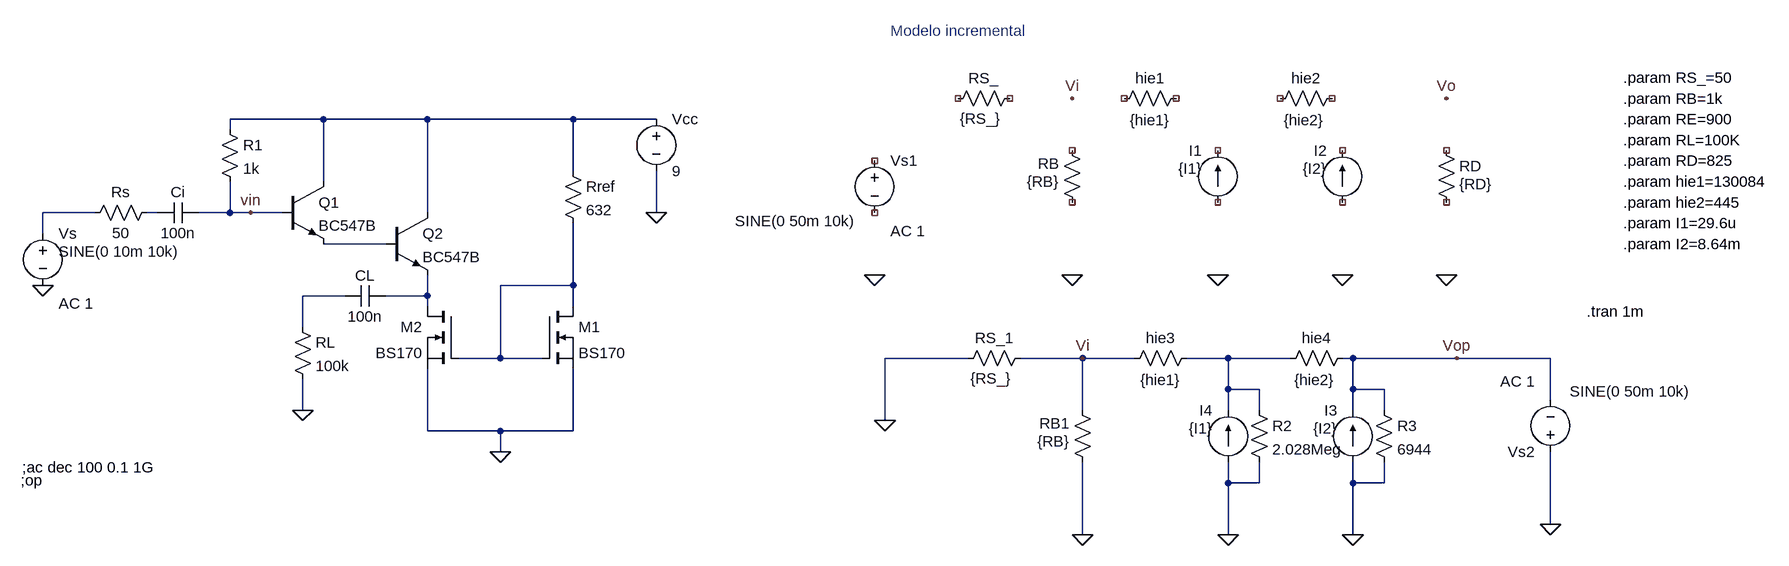
[diagram p0: schematic darlington.asc]
darlington.asc, the LTspice schematic file:
Version 4
SHEET 1 2424 680
WIRE 176 16 32 16
WIRE 336 16 176 16
WIRE 560 16 336 16
WIRE 688 16 560 16
WIRE 32 32 32 16
WIRE 560 96 560 16
WIRE 176 112 176 16
WIRE -176 160 -256 160
WIRE -80 160 -96 160
WIRE 32 160 32 112
WIRE 32 160 -16 160
WIRE 64 160 32 160
WIRE 112 160 64 160
WIRE 336 160 336 16
WIRE 688 160 688 96
WIRE -256 192 -256 160
WIRE 272 208 176 208
WIRE 560 272 560 176
WIRE 560 272 448 272
WIRE 208 288 144 288
WIRE 336 288 336 256
WIRE 336 288 272 288
WIRE 336 304 336 288
WIRE 560 304 560 272
WIRE 144 336 144 288
WIRE 448 384 448 272
WIRE 448 384 384 384
WIRE 512 384 448 384
WIRE 1168 384 1040 384
WIRE 1344 384 1248 384
WIRE 1424 384 1344 384
WIRE 1568 384 1504 384
WIRE 1664 384 1568 384
WIRE 1760 384 1744 384
WIRE 1920 384 1760 384
WIRE 2064 384 1920 384
WIRE 1568 432 1568 384
WIRE 1616 432 1568 432
WIRE 1760 432 1760 384
WIRE 1808 432 1760 432
WIRE 2064 448 2064 384
WIRE 144 464 144 416
WIRE 1344 464 1344 384
WIRE 1568 464 1568 432
WIRE 1616 464 1616 432
WIRE 1760 464 1760 432
WIRE 1808 464 1808 432
WIRE 1040 480 1040 384
WIRE 336 496 336 400
WIRE 448 496 336 496
WIRE 560 496 560 400
WIRE 560 496 448 496
WIRE 448 528 448 496
WIRE 1568 576 1568 544
WIRE 1616 576 1616 544
WIRE 1616 576 1568 576
WIRE 1760 576 1760 544
WIRE 1808 576 1808 544
WIRE 1808 576 1760 576
WIRE 2064 640 2064 528
WIRE 1344 656 1344 544
WIRE 1568 656 1568 576
WIRE 1760 656 1760 576
FLAG 688 160 0
FLAG -256 272 0
FLAG 64 160 vin
FLAG 448 528 0
FLAG 144 464 0
FLAG 1024 256 0
FLAG 1328 256 0
FLAG 1552 256 0
FLAG 1744 256 0
FLAG 1904 256 0
FLAG 1328 -16 Vi
FLAG 1904 -16 Vo
FLAG 1344 656 0
FLAG 1568 656 0
FLAG 1760 656 0
FLAG 1344 384 Vi
FLAG 1920 384 Vop
FLAG 1040 480 0
FLAG 2064 640 0
SYMBOL npn 112 112 R0
SYMATTR InstName Q1
SYMATTR Value BC547B
SYMBOL npn 272 160 R0
SYMATTR InstName Q2
SYMATTR Value BC547B
SYMBOL res 16 16 R0
SYMATTR InstName R1
SYMATTR Value 1k
SYMBOL voltage 688 0 R0
WINDOW 123 0 0 Left 0
WINDOW 39 0 0 Left 0
SYMATTR InstName Vcc
SYMATTR Value 9
SYMBOL cap -16 144 R90
WINDOW 0 0 32 VBottom 2
WINDOW 3 32 32 VTop 2
SYMATTR InstName Ci
SYMATTR Value 100n
SYMBOL voltage -256 176 R0
WINDOW 123 24 124 Left 2
WINDOW 39 0 0 Left 0
WINDOW 3 24 44 Left 2
SYMATTR Value2 AC 1
SYMATTR Value SINE(0 10m 10k)
SYMATTR InstName Vs
SYMBOL res -80 144 R90
WINDOW 0 0 56 VBottom 2
WINDOW 3 32 56 VTop 2
SYMATTR InstName Rs
SYMATTR Value 50
SYMBOL nmos 512 304 R0
SYMATTR InstName M1
SYMATTR Value BS170
SYMBOL nmos 384 304 M0
SYMATTR InstName M2
SYMATTR Value BS170
SYMBOL res 544 80 R0
SYMATTR InstName Rref
SYMATTR Value 632
SYMBOL cap 272 272 R90
WINDOW 0 0 32 VBottom 2
WINDOW 3 32 32 VTop 2
SYMATTR InstName CL
SYMATTR Value 100n
SYMBOL res 128 320 R0
SYMATTR InstName RL
SYMATTR Value 100k
SYMBOL voltage 1024 64 R0
WINDOW 123 24 124 Left 2
WINDOW 39 0 0 Left 0
WINDOW 3 -215 109 Left 2
SYMATTR Value2 AC 1
SYMATTR Value SINE(0 50m 10k)
SYMATTR InstName Vs1
SYMBOL res 1248 -32 R90
WINDOW 0 0 56 VBottom 2
WINDOW 3 63 61 VBottom 2
SYMATTR InstName RS_
SYMATTR Value {RS_}
SYMBOL res 1344 160 R180
WINDOW 0 36 76 Left 2
WINDOW 3 36 48 Left 2
SYMATTR InstName RB
SYMATTR Value {RB}
SYMBOL res 1392 0 R270
WINDOW 0 32 56 VTop 2
WINDOW 3 -33 56 VTop 2
SYMATTR InstName hie1
SYMATTR Value {hie1}
SYMBOL res 1888 48 R0
WINDOW 3 36 68 Left 2
SYMATTR InstName RD
SYMATTR Value {RD}
SYMBOL current 1744 144 R180
WINDOW 0 24 80 Left 2
WINDOW 3 24 52 Left 2
WINDOW 123 0 0 Left 0
WINDOW 39 0 0 Left 0
SYMATTR InstName I2
SYMATTR Value {I2}
SYMBOL current 1552 144 R180
WINDOW 0 24 80 Left 2
WINDOW 3 24 52 Left 2
WINDOW 123 0 0 Left 0
WINDOW 39 0 0 Left 0
SYMATTR InstName I1
SYMATTR Value {I1}
SYMBOL res 1744 -32 R90
WINDOW 0 0 56 VBottom 2
WINDOW 3 65 59 VBottom 2
SYMATTR InstName hie2
SYMATTR Value {hie2}
SYMBOL res 1264 368 R90
WINDOW 0 0 56 VBottom 2
WINDOW 3 63 61 VBottom 2
SYMATTR InstName RS_1
SYMATTR Value {RS_}
SYMBOL res 1360 560 R180
WINDOW 0 36 76 Left 2
WINDOW 3 36 48 Left 2
SYMATTR InstName RB1
SYMATTR Value {RB}
SYMBOL res 1408 400 R270
WINDOW 0 32 56 VTop 2
WINDOW 3 -33 56 VTop 2
SYMATTR InstName hie3
SYMATTR Value {hie1}
SYMBOL current 1760 544 R180
WINDOW 0 24 80 Left 2
WINDOW 3 24 52 Left 2
WINDOW 123 0 0 Left 0
WINDOW 39 0 0 Left 0
SYMATTR InstName I3
SYMATTR Value {I2}
SYMBOL current 1568 544 R180
WINDOW 0 24 80 Left 2
WINDOW 3 24 52 Left 2
WINDOW 123 0 0 Left 0
WINDOW 39 0 0 Left 0
SYMATTR InstName I4
SYMATTR Value {I1}
SYMBOL res 1760 368 R90
WINDOW 0 0 56 VBottom 2
WINDOW 3 65 59 VBottom 2
SYMATTR InstName hie4
SYMATTR Value {hie2}
SYMBOL res 1600 448 R0
SYMATTR InstName R2
SYMATTR Value 2.028Meg
SYMBOL res 1792 448 R0
SYMATTR InstName R3
SYMATTR Value 6944
SYMBOL voltage 2064 544 R180
WINDOW 123 24 124 Left 2
WINDOW 39 0 0 Left 0
WINDOW 3 -215 109 Left 2
SYMATTR Value2 AC 1
SYMATTR Value SINE(0 50m 10k)
SYMATTR InstName Vs2
TEXT -288 552 Left 2 !;ac dec 100 0.1 1G
TEXT 1048 -120 Left 2 ;Modelo incremental
TEXT 2176 -48 Left 2 !.param RS_=50
TEXT 2176 -16 Left 2 !.param RB=1k
TEXT 2176 16 Left 2 !.param RE=900
TEXT 2176 48 Left 2 !.param RL=100K
TEXT 2176 80 Left 2 !.param RD=825
TEXT 2176 112 Left 2 !.param hie1=130084
TEXT 2176 144 Left 2 !.param hie2=445
TEXT 2176 176 Left 2 !.param I1=29.6u
TEXT 2176 208 Left 2 !.param I2=8.64m
TEXT -290 572 Left 2 !;op
TEXT 2120 312 Left 2 !.tran 1m

The netlist it stands for:
* darlington.asc
Q1 N001 vin N004 0 BC547B
Q2 N001 N004 N007 0 BC547B
R1 N001 vin 1k
Vcc N001 0 9
Ci vin N003 100n
Vs N002 0 SINE(0 10m 10k) AC 1
Rs N003 N002 50
M1 N005 N005 0 0 BS170
M2 N007 N005 0 0 BS170
Rref N001 N005 632
CL N007 N006 100n
RL N006 0 100k
Vs1 NC_01 NC_02 SINE(0 50m 10k) AC 1
RS_ NC_03 NC_04 {RS_}
RB NC_05 NC_06 {RB}
R§hie1 NC_07 NC_08 {hie1}
RD NC_09 NC_10 {RD}
I2 NC_11 NC_12 {I2}
I1 NC_13 NC_14 {I1}
R§hie2 NC_15 NC_16 {hie2}
RS_1 Vi 0 {RS_}
RB1 0 Vi {RB}
R§hie3 Vi N008 {hie1}
I3 0 Vop {I2}
I4 0 N008 {I1}
R§hie4 Vop N008 {hie2}
R2 N008 0 2.028Meg
R3 Vop 0 6944
Vs2 0 Vop SINE(0 50m 10k) AC 1
.model NPN NPN
.model PNP PNP
.lib standard.bjt
.model NMOS NMOS
.model PMOS PMOS
.lib standard.mos
;ac dec 100 0.1 1G
* Modelo incremental
.param RS_=50
.param RB=1k
.param RE=900
.param RL=100K
.param RD=825
.param hie1=130084
.param hie2=445
.param I1=29.6u
.param I2=8.64m
;op
.tran 1m
.backanno
.end